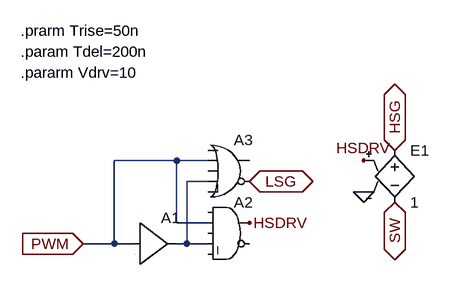
[diagram p0: schematic HBDRV.asc]
HBDRV.asc, the LTspice schematic file:
Version 4
SHEET 1 880 680
WIRE 64 112 -32 112
WIRE 112 112 64 112
WIRE 112 144 80 144
WIRE 64 208 64 112
WIRE 112 208 64 208
WIRE -32 240 -32 112
WIRE -32 240 -80 240
WIRE 0 240 -32 240
WIRE 80 240 80 144
WIRE 80 240 64 240
WIRE 112 240 80 240
FLAG -80 240 PWM
IOPIN -80 240 In
FLAG 176 208 HSDRV
FLAG 176 144 LSG
IOPIN 176 144 BiDir
FLAG 352 112 HSDRV
FLAG 400 176 SW
IOPIN 400 176 BiDir
FLAG 400 96 HSG
IOPIN 400 96 BiDir
FLAG 352 160 0
SYMBOL Digital\\buf1 0 176 R0
WINDOW 3 8 104 Invisible 2
SYMATTR InstName A1
SYMATTR Value Trise={Tdel}
SYMATTR Value2 Vhigh={Vdrv}
SYMBOL Digital\\and 144 160 R0
WINDOW 3 16 112 Invisible 2
SYMATTR Value Vhigh={Vdrv}
SYMATTR InstName A2
SYMATTR Value2 Trise={Trise}
SYMBOL Digital\\or 144 64 R0
WINDOW 3 -8 36 Invisible 2
SYMATTR Value Vhigh={Vdrv}
SYMATTR InstName A3
SYMATTR Value2 Trise={Trise}
SYMBOL e 400 80 R0
SYMATTR InstName E1
SYMATTR Value 1
TEXT -176 -56 Left 2 !.param Tdel=200n
TEXT -176 -24 Left 2 !.pararm Vdrv=10
TEXT -176 -88 Left 2 !.prarm Trise=50n

The netlist it stands for:
* HBDRV.asc
A1 PWM 0 0 0 0 0 N001 0 BUF Trise={Tdel} Vhigh={Vdrv}
A2 0 PWM 0 N001 0 0 HSDRV 0 AND Vhigh={Vdrv} Trise={Trise}
A3 0 PWM 0 N001 0 LSG 0 0 OR Vhigh={Vdrv} Trise={Trise}
E1 HSG SW HSDRV 0 1
.param Tdel=200n
.pararm Vdrv=10
.prarm Trise=50n
.backanno
.end